# Altium project pt100.PrjPCB
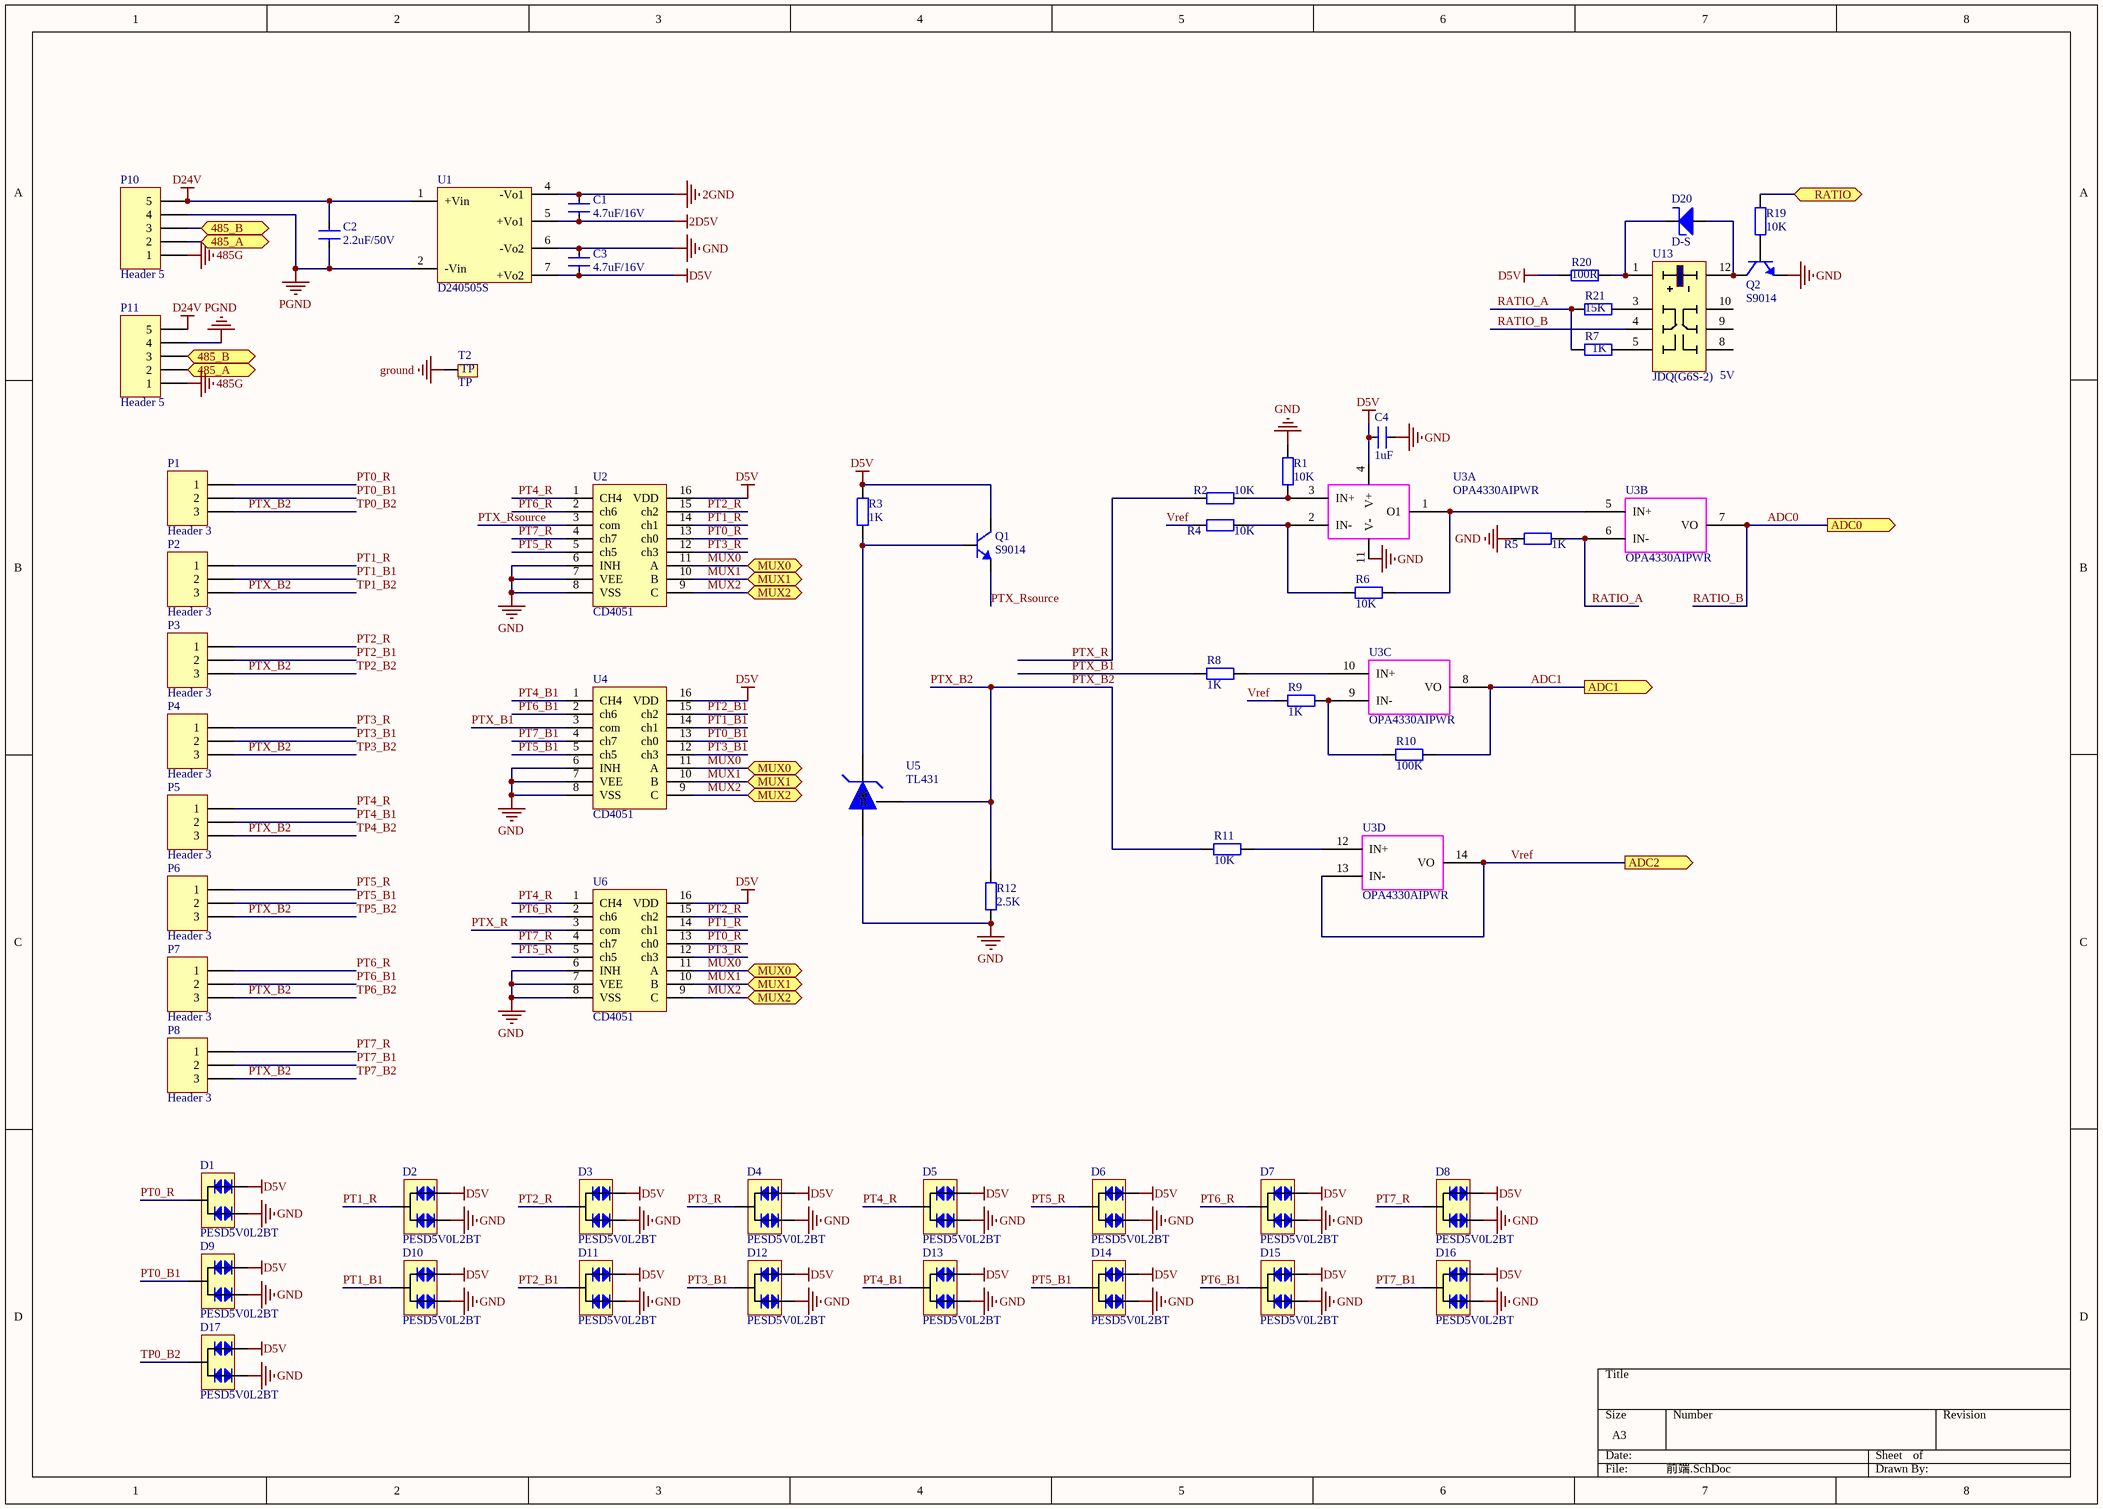
[diagram p0: 前端.SchDoc]
2 sheets, 94 parts. Net scope: flat (ports and power ports of the same name join across sheets).
Board file: PTx-V1.PcbDoc
Sheets:
  前端.SchDoc
  mcu.SchDoc

## Sheet 前端.SchDoc
size A3

### Parts
C1  4.7uF/16V  [0805C]
C2  2.2uF/50V  [0805C]
C3  4.7uF/16V  [0805C]
C4  1uF  [0603C]
D1  PESD5V0L2BT  [SOT23A]
D2  PESD5V0L2BT  [SOT23A]
D3  PESD5V0L2BT  [SOT23A]
D4  PESD5V0L2BT  [SOT23A]
D5  PESD5V0L2BT  [SOT23A]
D6  PESD5V0L2BT  [SOT23A]
D7  PESD5V0L2BT  [SOT23A]
D8  PESD5V0L2BT  [SOT23A]
D9  PESD5V0L2BT  [SOT23A]
D10  PESD5V0L2BT  [SOT23A]
D11  PESD5V0L2BT  [SOT23A]
D12  PESD5V0L2BT  [SOT23A]
D13  PESD5V0L2BT  [SOT23A]
D14  PESD5V0L2BT  [SOT23A]
D15  PESD5V0L2BT  [SOT23A]
D16  PESD5V0L2BT  [SOT23A]
D17  PESD5V0L2BT  [SOT23A]
D20  D-S  [SOD123]
P1  Header 3  [KF2DEG-3.81-3]
P2  Header 3  [KF2DEG-3.81-3]
P3  Header 3  [KF2DEG-3.81-3]
P4  Header 3  [KF2DEG-3.81-3]
P5  Header 3  [KF2DEG-3.81-3]
P6  Header 3  [KF2DEG-3.81-3]
P7  Header 3  [KF2DEG-3.81-3]
P8  Header 3  [KF2DEG-3.81-3]
P10  Header 5  [KF2DEG-3.81-5]
P11  Header 5  [KF2DEG-3.81-5]
Q1  S9014  [SOT23A]
Q2  S9014  [SOT23A]
R1  10K  [0603R]
R2  10K  [0603R]
R3  1K  [0603R]
R4  10K  [0603R]
R5  1K  [0603R]
R6  10K  [0603R]
R7  1K  [0603R]
R8  1K  [0603R]
R9  1K  [0603R]
R10  100K  [0603R]
R11  10K  [0603R]
R12  2.5K  [0603R]
R19  10K  [0603R]
R20  100R  [0603R]
R21  15K  [0603R]
T2  TP  [TP1]
U1  D240505S  [D240505S-2W]
U2  CD4051  [SOP16]
U3  OPA4330AIPWR  [TSSOP14-65]  (parts A,B,C,D of 4)
U4  CD4051  [SOP16]
U5  TL431  [SOT-89]
U6  CD4051  [SOP16]
U13  JDQ(G6S-2)  [JDQ-G6S-2]

### Ports
485_A, 485_B, ADC0 (out), ADC1 (out), ADC2 (out), MUX0, MUX1, MUX2, RATIO

### Nets
2D5V: C1.2 U1.5(+Vo1)
2GND: C1.1 U1.4(-Vo1)
485G: P10.1 P11.1
D5V: C3.2 C4.2 D1.2 D2.2 D3.2 D4.2 D5.2 D6.2 D7.2 D8.2 D9.2 D10.2 D11.2 D12.2 D13.2 D14.2 D15.2 D16.2 D17.2 Q1.C R3.2 R20.2 U1.7(+Vo2) U2.16(VDD) U3.4(V+) U4.16(VDD) U6.16(VDD)
D24V: C2.1 P10.5 P11.5 U1.1(+Vin)
GND: C3.1 C4.1 D1.1 D2.1 D3.1 D4.1 D5.1 D6.1 D7.1 D8.1 D9.1 D10.1 D11.1 D12.1 D13.1 D14.1 D15.1 D16.1 D17.1 Q2.E R1.1 R5.2 R12.1 U1.6(-Vo2) U2.6(INH) U2.7(VEE) U2.8(VSS) U3.11(V-) U4.6(INH) U4.7(VEE) U4.8(VSS) U5.2(A) U6.6(INH) U6.7(VEE) U6.8(VSS)
ground: T2.1
PGND: C2.2 P10.4 P11.4 U1.2(-Vin)
485A: P10.2 P11.2 ; port 485_A
485B: P10.3 P11.3 ; port 485_B
ADC0: U3.7(VO) U13.4 ; port ADC0  [also labelled RATIO_B]
ADC1: R10.1 U3.8(VO) ; port ADC1
MUX0: U2.11(A) U4.11(A) U6.11(A) ; port MUX0
MUX1: U2.10(B) U4.10(B) U6.10(B) ; port MUX1
MUX2: U2.9(C) U4.9(C) U6.9(C) ; port MUX2
PB10: R19.1 ; port RATIO
PT0_B1: D9.3 P1.2 U4.13(ch0)
PT0_R: D1.3 P1.1 U2.13(ch0) U6.13(ch0)
PT1_B1: D10.3 P2.2 U4.14(ch1)
PT1_R: D2.3 P2.1 U2.14(ch1) U6.14(ch1)
PT2_B1: D11.3 P3.2 U4.15(ch2)
PT2_R: D3.3 P3.1 U2.15(ch2) U6.15(ch2)
PT3_B1: D12.3 P4.2 U4.12(ch3)
PT3_R: D4.3 P4.1 U2.12(ch3) U6.12(ch3)
PT4_B1: D13.3 P5.2 U4.1(CH4)
PT4_R: D5.3 P5.1 U2.1(CH4) U6.1(CH4)
PT5_B1: D14.3 P6.2 U4.5(ch5)
PT5_R: D6.3 P6.1 U2.5(ch5) U6.5(ch5)
PT6_B1: D15.3 P7.2 U4.2(ch6)
PT6_R: D7.3 P7.1 U2.2(ch6) U6.2(ch6)
PT7_B1: D16.3 P8.2 U4.4(ch7)
PT7_R: D8.3 P8.1 U2.4(ch7) U6.4(ch7)
PTX_B1: R8.2 U4.3(com)
PTX_B2: D17.3 P1.3 P2.3 P3.3 P4.3 P5.3 P6.3 P7.3 P8.3 R11.2 R12.2 U5.1(R)  [also labelled TP0_B2, TP1_B2, TP2_B2, TP3_B2, TP4_B2, TP5_B2, TP6_B2, TP7_B2]
PTX_R: R2.2 U6.3(com)
PTX_Rsource: Q1.E U2.3(com)
RATIO_A: R5.1 R7.1 R21.1 U3.6(IN-)
Vref: R4.2 R9.2 U3.13(IN-) U3.14(VO) ; port ADC2
NetD20_A: D20.A Q2.C U13.12
NetD20_K: D20.K R20.1 U13.1
NetQ1_B: Q1.B R3.1 U5.3(K)
NetQ2_B: Q2.B R19.2
NetR1_2: R1.2 R2.1 U3.3(IN+)
NetR4_1: R4.1 R6.2 U3.2(IN-)
NetR6_1: R6.1 U3.1(O1) U3.5(IN+)
NetR7_2: R7.2 U13.5
NetR8_1: R8.1 U3.10(IN+)
NetR9_1: R9.1 R10.2 U3.9(IN-)
NetR11_1: R11.1 U3.12(IN+)
NetR21_2: R21.2 U13.3

Not connected (* = marked no-connect by the designer): U13 8 9 10

### Notes on the sheet
- (near U13) 5V

### Library data of the parts
C1-C4 = CAP: 普通小电容; 电压: 50V
D1-D17 = PESD5V0L2BT: schottky diod
D20 = D-S: 肖特基二极管
P1-P8 = Header 3: Header, 3-Pin; LatestRevisionDate: 17-Jul-2002; LatestRevisionNote: Re-released for DXP Platform.; Publisher: Altium Limited
P10 P11 = Header 5: Header, 5-Pin; LatestRevisionDate: 17-Jul-2002; LatestRevisionNote: Re-released for DXP Platform.; Publisher: Altium Limited
Q1 Q2 = NPN: NPN三极管; pin to pad: B>1 C>3 E>2; Published: 8-Jun-2000; LatestRevisionDate: 15-Jan-2003; LatestRevisionNote: PCB Footprint 'BCY-W3/D4.7' replaced; DatasheetDocument: 1997; PackageDocument: Sep-1998; PackageReference: TO-92A; Publisher: Altium Limited; Code_JEDEC: TO-92A; ComponentLink1Description: Manufacturer Link; ComponentLink1URL: http://www.fairchildsemi.com/; ComponentLink2Description: Datasheet; ComponentLink2URL: http://www.fairchildsemi.com/ds/2N%2F2N3904.pdf
R1-R12 R19-R21 = RES: 普通电阻
T2 = TP: testpoint
U1 = D240505S-2W: 24V转双5V隔离DCDC
U2 U4 U6 = CD4051: 模拟多路复用器
U3 = OPA4330: 输出轨到轨，4运放
U13 = JDQ(G6S-2): 继电器（G6S-2 5VDC）

## Sheet mcu.SchDoc
size A3
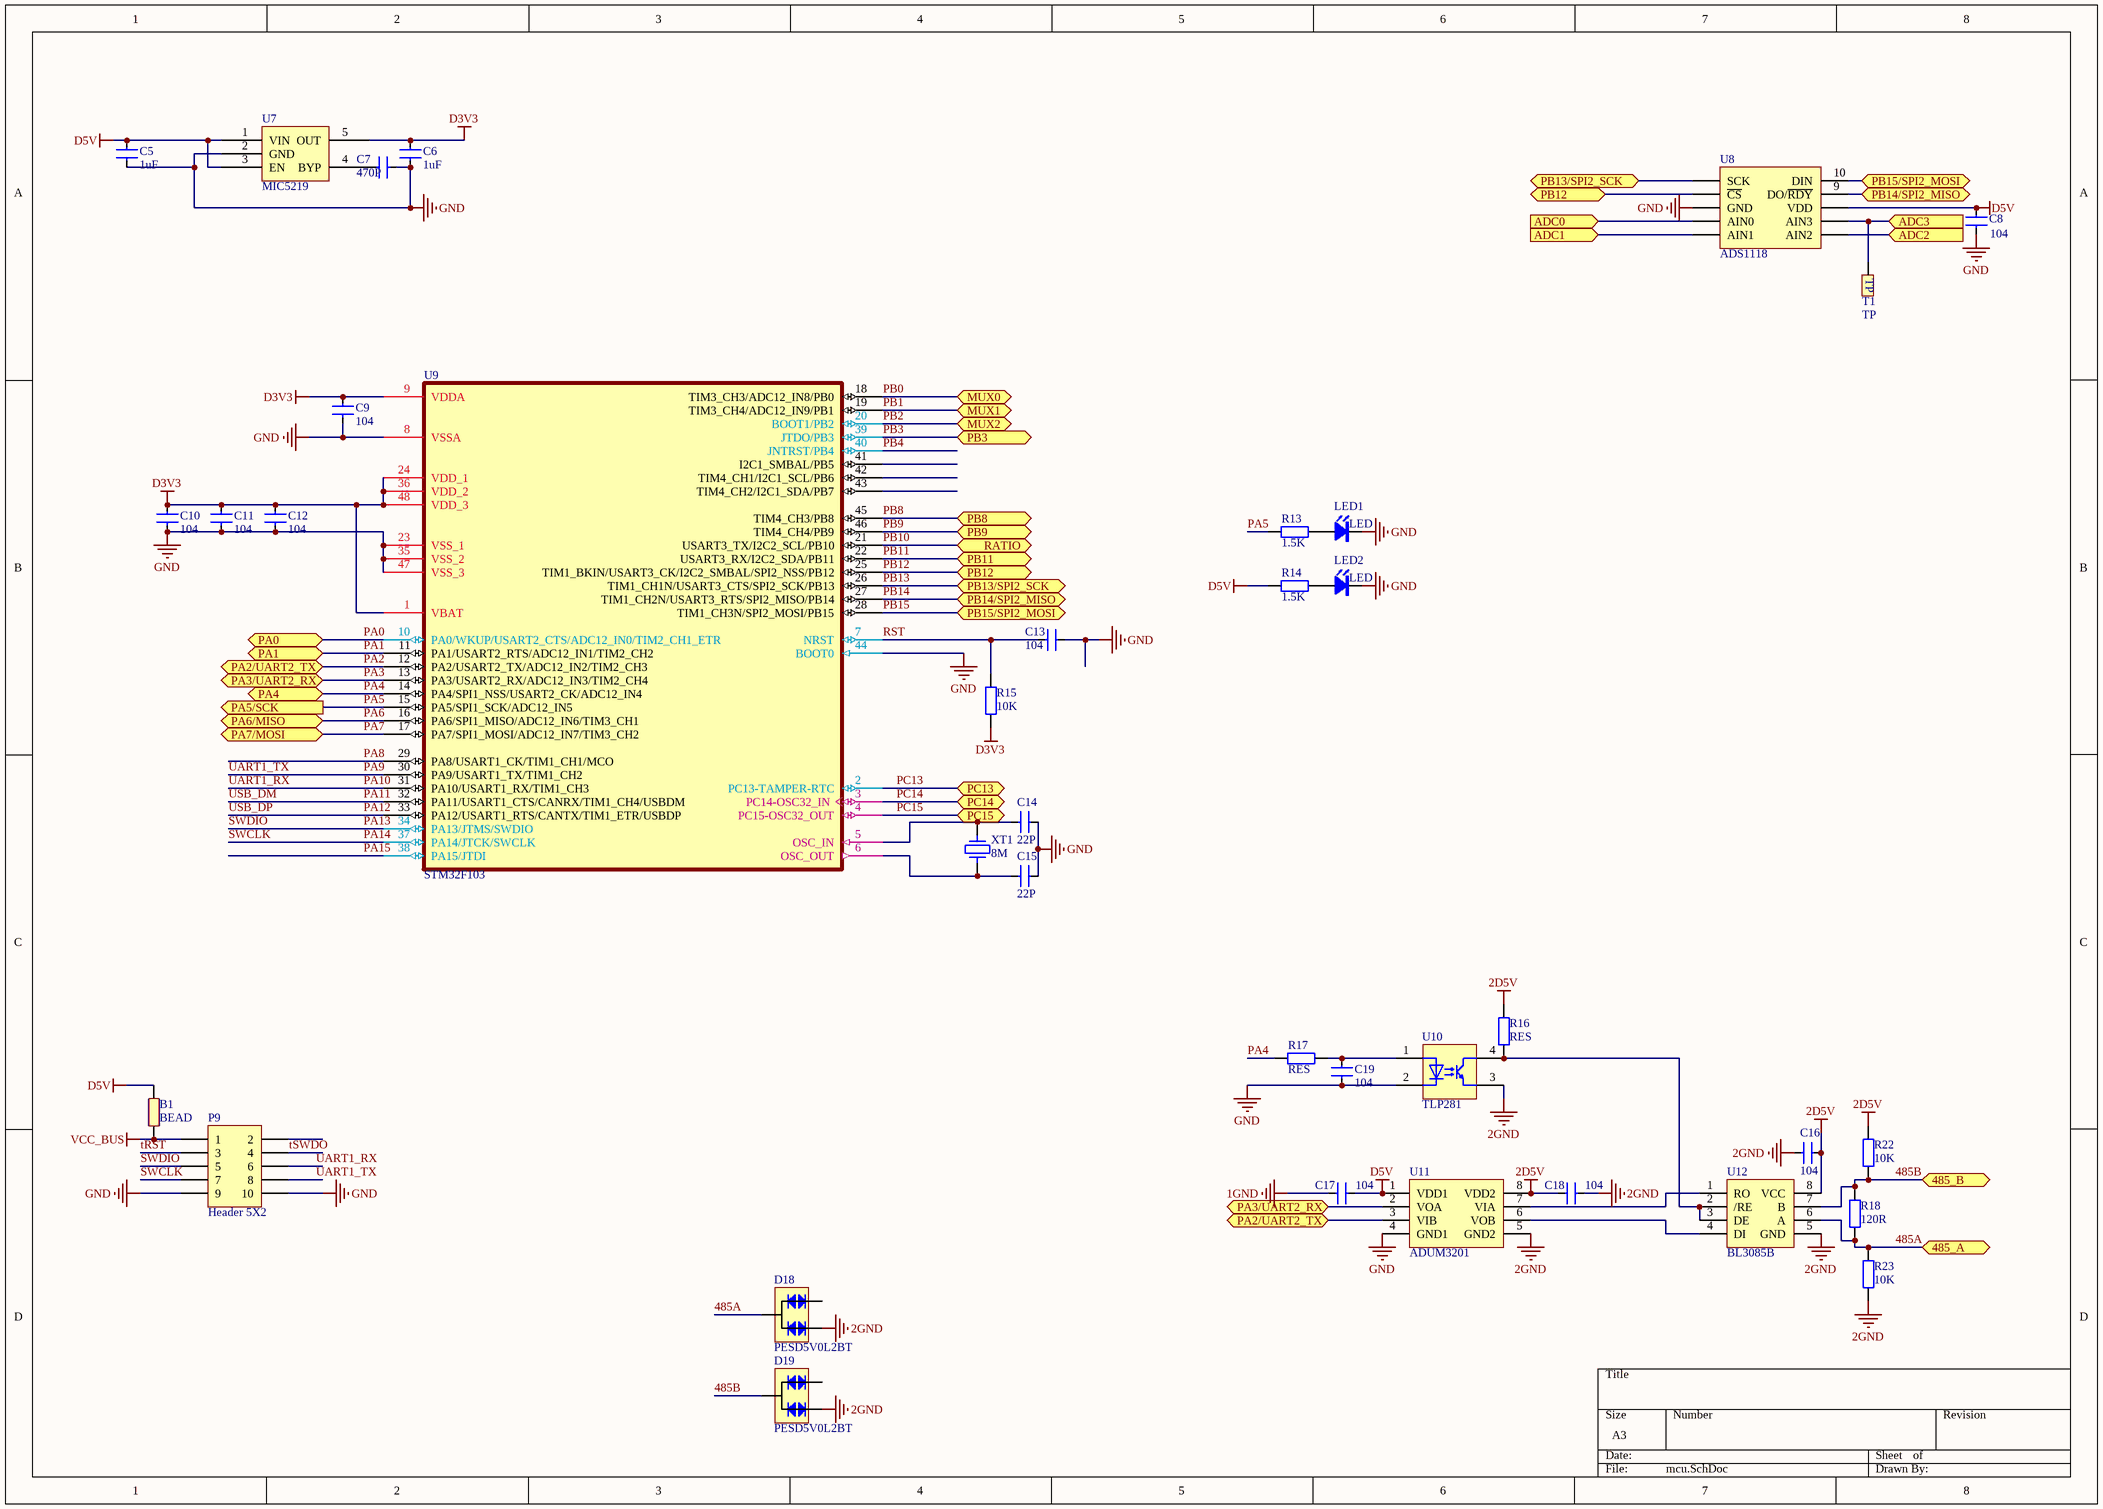
[diagram p1: mcu.SchDoc]

### Parts
B1  BEAD  [0603L]
C5  1uF  [0805C]
C6  1uF  [0805C]
C7  470P  [0603C]
C8  104  [0603C]
C9  104  [0603C]
C10  104  [0603C]
C11  104  [0603C]
C12  104  [0603C]
C13  104  [0603C]
C14  22P  [0603C]
C15  22P  [0603C]
C16  104  [0603C]
C17  104  [0603C]
C18  104  [0603C]
C19  104  [0603C]
D18  PESD5V0L2BT  [SOT23A]
D19  PESD5V0L2BT  [SOT23A]
LED1  LED  [LED-3]
LED2  LED  [LED-3]
P9  Header 5X2  [DC2.54-10]
R13  1.5K  [0603R]
R14  1.5K  [0603R]
R15  10K  [0603R]
R16  RES  [0603R]
R17  RES  [0603R]
R18  120R  [0603R]
R22  10K  [0603R]
R23  10K  [0603R]
T1  TP  [TESTP]
U7  MIC5219  [SOT23-5]
U8  ADS1118  [TSSOP10]
U9  STM32F103  [LQFP48]
U10  TLP281  [SOP4]
U11  ADUM3201  [SOP8]
U12  BL3085B  [SOP8]
XT1  8M  [5032]

### Ports
485_A, 485_B, ADC0 (in), ADC1 (in), ADC2 (in), ADC3 (in), MUX0, MUX1, MUX2, PA0, PA1, PA2/UART2_TX, PA3/UART2_RX, PA4, PA5/SCK (out), PA6/MISO, PA7/MOSI, PB3, PB8, PB9, PB11, PB12, PB13/SPI2_SCK, PB14/SPI2_MISO, PB15/SPI2_MOSI, PC13, PC14, PC15, RATIO

### Nets
1GND: C17.2
2D5V: C16.2 C18.2 R16.2 R22.2 U11.8(VDD2) U12.8(VCC)
2GND: C16.1 C18.1 D18.1 D19.1 R23.1 U10.3 U11.5(GND2) U12.5(GND)
D3V3: C6.2 C9.2 C10.2 C11.1 C12.2 R15.1 U7.5(OUT) U9.1(VBAT) U9.9(VDDA) U9.24(VDD_1) U9.36(VDD_2) U9.48(VDD_3)
D5V: B1.2 C5.2 C8.2 C17.1 R14.1 U7.1(VIN) U7.3(EN) U8.8(VDD) U11.1(VDD1)
GND: C5.1 C6.1 C7.2 C8.1 C9.1 C10.1 C11.2 C12.1 C13.2 C14.2 C15.2 C19.2 LED1.K LED2.K P9.9 P9.10 U7.2(GND) U8.3(GND) U9.8(VSSA) U9.23(VSS_1) U9.35(VSS_2) U9.44(BOOT0) U9.47(VSS_3) U10.2 U11.4(GND1)
VCC_BUS: B1.1 P9.1
485A: D18.3 R18.1 R23.2 U12.6(A) ; port 485_A
485B: D19.3 R18.2 R22.1 U12.7(B) ; port 485_B
ADC0: U8.4(AIN0) ; port ADC0
ADC1: U8.5(AIN1) ; port ADC1
PA0: U9.10(PA0/WKUP/USART2_CTS/ADC12_IN0/TIM2_CH1_ETR) ; port PA0
PA1: U9.11(PA1/USART2_RTS/ADC12_IN1/TIM2_CH2) ; port PA1
PA2: U9.12(PA2/USART2_TX/ADC12_IN2/TIM2_CH3) U11.3(VIB) ; port PA2/UART2_TX
PA3: U9.13(PA3/USART2_RX/ADC12_IN3/TIM2_CH4) U11.2(VOA) ; port PA3/UART2_RX
PA4: R17.2 U9.14(PA4/SPI1_NSS/USART2_CK/ADC12_IN4) ; port PA4
PA5: R13.1 U9.15(PA5/SPI1_SCK/ADC12_IN5) ; port PA5/SCK
PA6: U9.16(PA6/SPI1_MISO/ADC12_IN6/TIM3_CH1) ; port PA6/MISO
PA7: U9.17(PA7/SPI1_MOSI/ADC12_IN7/TIM3_CH2) ; port PA7/MOSI
PA8: U9.29(PA8/USART1_CK/TIM1_CH1/MCO)
PA9: P9.8 U9.30(PA9/USART1_TX/TIM1_CH2)  [also labelled UART1_TX]
PA10: P9.6 U9.31(PA10/USART1_RX/TIM1_CH3)  [also labelled UART1_RX]
PA11: U9.32(PA11/USART1_CTS/CANRX/TIM1_CH4/USBDM)  [also labelled USB_DM]
PA12: U9.33(PA12/USART1_RTS/CANTX/TIM1_ETR/USBDP)  [also labelled USB_DP]
PA13: P9.5 U9.34(PA13/JTMS/SWDIO)  [also labelled SWDIO]
PA14: P9.7 U9.37(PA14/JTCK/SWCLK)  [also labelled SWCLK]
PA15: U9.38(PA15/JTDI)
PB0: U9.18(TIM3_CH3/ADC12_IN8/PB0) ; port MUX0  [project net MUX0]
PB1: U9.19(TIM3_CH4/ADC12_IN9/PB1) ; port MUX1  [project net MUX1]
PB2: U9.20(BOOT1/PB2) ; port MUX2  [project net MUX2]
PB3: U9.39(JTDO/PB3) ; port PB3
PB4: U9.40(JNTRST/PB4)
PB8: U9.45(TIM4_CH3/PB8) ; port PB8
PB9: U9.46(TIM4_CH4/PB9) ; port PB9
PB10: U9.21(USART3_TX/I2C2_SCL/PB10) ; port RATIO
PB11: U9.22(USART3_RX/I2C2_SDA/PB11) ; port PB11
PB12: U8.2(~{CS}) U9.25(TIM1_BKIN/USART3_CK/I2C2_SMBAL/SPI2_NSS/PB12) ; port PB12
PB13: U8.1(SCK) U9.26(TIM1_CH1N/USART3_CTS/SPI2_SCK/PB13) ; port PB13/SPI2_SCK
PB14: U8.9(DO/~{RDY}) U9.27(TIM1_CH2N/USART3_RTS/SPI2_MISO/PB14) ; port PB14/SPI2_MISO
PB15: U8.10(DIN) U9.28(TIM1_CH3N/SPI2_MOSI/PB15) ; port PB15/SPI2_MOSI
PC13: U9.2(PC13-TAMPER-RTC) ; port PC13
PC14: U9.3(PC14-OSC32_IN) ; port PC14
PC15: U9.4(PC15-OSC32_OUT) ; port PC15
RST: C13.1 R15.2 U9.7(NRST)
tRST: P9.3
tSWDO: P9.4
Vref: U8.6(AIN2) ; port ADC2
NetC7_1: C7.1 U7.4(BYP)
NetC14_1: C14.1 U9.5(OSC_IN) XT1.1
NetC15_1: C15.1 U9.6(OSC_OUT) XT1.2
NetC19_1: C19.1 R17.1 U10.1
NetLED1_A: LED1.A R13.2
NetLED2_A: LED2.A R14.2
NetR16_1: R16.1 U10.4 U12.2(/RE) U12.3(DE)
NetT1_1: T1.1 U8.7(AIN3) ; port ADC3
NetU11_6: U11.6(VOB) U12.4(DI)
NetU11_7: U11.7(VIA) U12.1(RO)

Not connected (* = marked no-connect by the designer): D18 2; D19 2; P9 2; U9 41(I2C1_SMBAL/PB5) 42(TIM4_CH1/I2C1_SCL/PB6) 43(TIM4_CH2/I2C1_SDA/PB7)

### Notes on the sheet
- Labels drawn without touching a wire or pin: ENC1, ENC2, ENC3

### Library data of the parts
B1 = BEAD: 磁珠
C5 C6 C8 = CAP: 普通小电容; 电压: 50V
C7 C9-C19 = CAP: 普通小电容
D18 D19 = PESD5V0L2BT: schottky diod
P9 = Header 5X2: Header, 5-Pin, Dual row; LatestRevisionDate: 17-Jul-2002; LatestRevisionNote: Re-released for DXP Platform.; Publisher: Altium Limited
R13-R18 R22 R23 = RES: 普通电阻
T1 = TP: testpoint
U8 = ADS1118: 16λ ADC
U10 = TLP281: TLP281 光耦
U12 = BL3085B: BL3085B 15KV防静电485
XT1 = XT: 晶振

## Nets that join several sheets
2D5V: 前端 (C1.2 U1.5), mcu (6 pins)
2GND: 前端 (C1.1 U1.4), mcu (8 pins)
D5V: 前端 (27 pins), mcu (9 pins)
GND: 前端 (35 pins), mcu (25 pins)
485A: 前端 (P10.2 P11.2), mcu (D18.3 R18.1 R23.2 U12.6)
485B: 前端 (P10.3 P11.3), mcu (D19.3 R18.2 R22.1 U12.7)
ADC0: 前端 (U3.7 U13.4), mcu (U8.4)
ADC1: 前端 (R10.1 U3.8), mcu (U8.5)
MUX0: 前端 (U2.11 U4.11 U6.11), mcu (U9.18)
MUX1: 前端 (U2.10 U4.10 U6.10), mcu (U9.19)
MUX2: 前端 (U2.9 U4.9 U6.9), mcu (U9.20)
PB10: 前端 (R19.1), mcu (U9.21)
Vref: 前端 (R4.2 R9.2 U3.13 U3.14), mcu (U8.6)